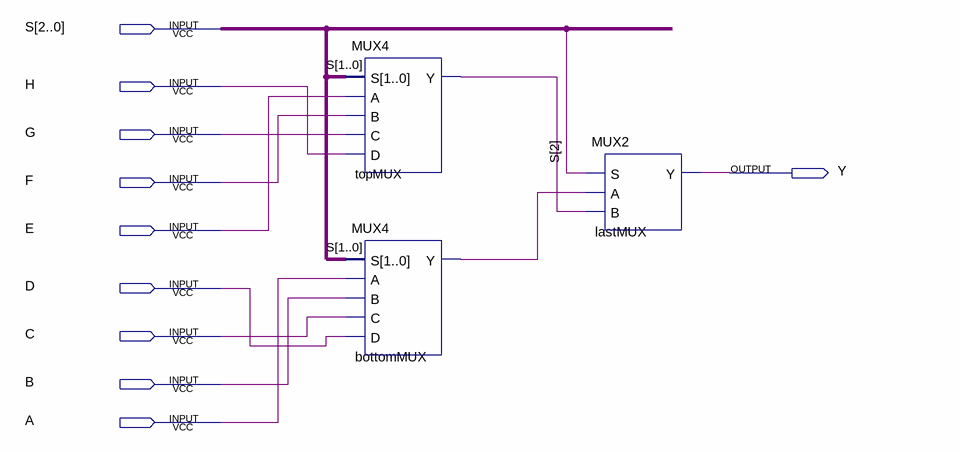
[diagram p0: schematic sheet]
// Quartus schematic MUX8.bdf as structural Verilog: 3 symbols, 10 pins
module MUX8 (
  input  [2:0] S,
  input  H,
  input  G,
  input  F,
  input  E,
  input  D,
  input  C,
  input  B,
  input  A,
  output Y
);

  wire bottomMUX_y, topMUX_y;

  MUX4 topMUX (.S(S[1:0]), .A(E), .B(F), .C(G), .D(H), .Y(topMUX_y));
  MUX4 bottomMUX (.S(S[1:0]), .A(A), .B(B), .C(C), .D(D), .Y(bottomMUX_y));
  MUX2 lastMUX (.S(S[2]), .A(bottomMUX_y), .B(topMUX_y), .Y(Y));
endmodule
